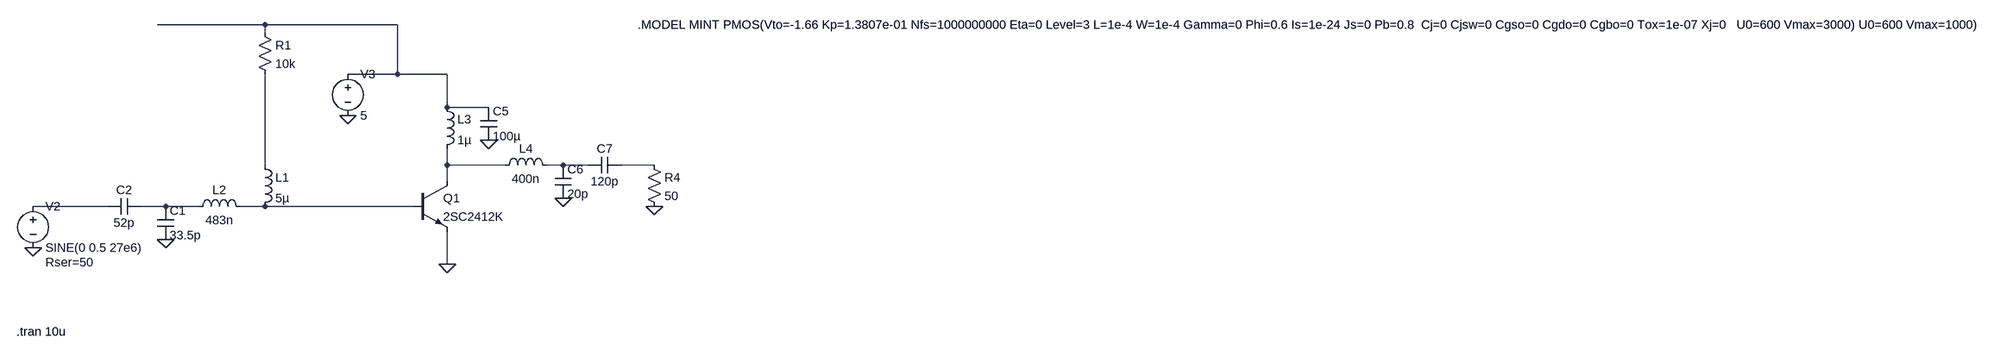
[diagram p0: schematic Amp_Power_27Mhz.asc]
Amp_Power_27Mhz.asc, the LTspice schematic file:
Version 4
SHEET 1 3440 680
WIRE -112 -176 -320 -176
WIRE 144 -176 -112 -176
WIRE -112 -160 -112 -176
WIRE 144 -80 144 -176
WIRE 144 -80 48 -80
WIRE 240 -80 144 -80
WIRE 240 -16 240 -80
WIRE 320 -16 240 -16
WIRE -112 96 -112 -80
WIRE 240 96 240 64
WIRE 352 96 240 96
WIRE 464 96 432 96
WIRE 512 96 464 96
WIRE 640 96 576 96
WIRE 240 128 240 96
WIRE -416 176 -560 176
WIRE -304 176 -352 176
WIRE -240 176 -304 176
WIRE -112 176 -160 176
WIRE 176 176 -112 176
WIRE 240 288 240 224
FLAG 240 288 0
FLAG -304 240 0
FLAG 320 48 0
FLAG 640 176 0
FLAG 464 160 0
FLAG -560 256 0
FLAG 48 0 0
SYMBOL npn 176 128 R0
SYMATTR InstName Q1
SYMATTR Value 2SC2412K
SYMBOL ind -128 80 R0
SYMATTR InstName L1
SYMATTR Value 5µ
SYMBOL ind -256 192 R270
WINDOW 0 32 56 VTop 2
WINDOW 3 5 56 VBottom 2
SYMATTR InstName L2
SYMATTR Value 483n
SYMBOL cap -320 176 R0
SYMATTR InstName C1
SYMATTR Value 33.5p
SYMBOL cap -352 160 R90
WINDOW 0 0 32 VBottom 2
WINDOW 3 32 32 VTop 2
SYMATTR InstName C2
SYMATTR Value 52p
SYMBOL ind 224 -32 R0
SYMATTR InstName L3
SYMATTR Value 1µ
SYMBOL ind 336 112 R270
WINDOW 0 32 56 VTop 2
WINDOW 3 5 56 VBottom 2
SYMATTR InstName L4
SYMATTR Value 400n
SYMBOL cap 304 -16 R0
SYMATTR InstName C5
SYMATTR Value 100µ
SYMBOL cap 448 96 R0
SYMATTR InstName C6
SYMATTR Value 20p
SYMBOL cap 576 80 R90
WINDOW 0 0 32 VBottom 2
WINDOW 3 32 32 VTop 2
SYMATTR InstName C7
SYMATTR Value 120p
SYMBOL res 624 80 R0
SYMATTR InstName R4
SYMATTR Value 50
SYMBOL voltage -560 160 R0
WINDOW 123 0 0 Left 0
WINDOW 39 24 124 Left 2
SYMATTR SpiceLine Rser=50
SYMATTR InstName V2
SYMATTR Value SINE(0 0.5 27e6)
SYMBOL voltage 48 -96 R0
WINDOW 123 0 0 Left 0
WINDOW 39 0 0 Left 0
SYMATTR InstName V3
SYMATTR Value 5
SYMBOL res -128 -176 R0
SYMATTR InstName R1
SYMATTR Value 10k
TEXT -592 520 Left 2 !.tran 10u
TEXT 608 -176 Left 2 !.MODEL MINT PMOS(Vto=-1.66 Kp=1.3807e-01 Nfs=1000000000 Eta=0 Level=3 L=1e-4 W=1e-4 Gamma=0 Phi=0.6 Is=1e-24 Js=0 Pb=0.8  Cj=0 Cjsw=0 Cgso=0 Cgdo=0 Cgbo=0 Tox=1e-07 Xj=0   U0=600 Vmax=3000) U0=600 Vmax=1000)

The netlist it stands for:
* Amp_Power_27Mhz.asc
Q1 N003 N008 0 0 2SC2412K
L1 N002 N008 5µ
L2 N007 N008 483n
C1 N007 0 33.5p
C2 N007 N006 52p
L3 N001 N003 1µ
L4 N003 N004 400n
C5 N001 0 100µ
C6 N004 0 20p
C7 N005 N004 120p
R4 N005 0 50
V2 N006 0 SINE(0 0.5 27e6) Rser=50
V3 N001 0 5
R1 N001 N002 10k
.model NPN NPN
.model PNP PNP
.lib standard.bjt
.tran 10u
.MODEL MINT PMOS(Vto=-1.66 Kp=1.3807e-01 Nfs=1000000000 Eta=0 Level=3 L=1e-4 W=1e-4 Gamma=0 Phi=0.6 Is=1e-24 Js=0 Pb=0.8  Cj=0 Cjsw=0 Cgso=0 Cgdo=0 Cgbo=0 Tox=1e-07 Xj=0   U0=600 Vmax=3000) U0=600 Vmax=1000)
.backanno
.end